# Altium schematic sheet cpuofmicrocontroller.SchDoc
size A4; SheetNumber: 4; SheetTotal: 5
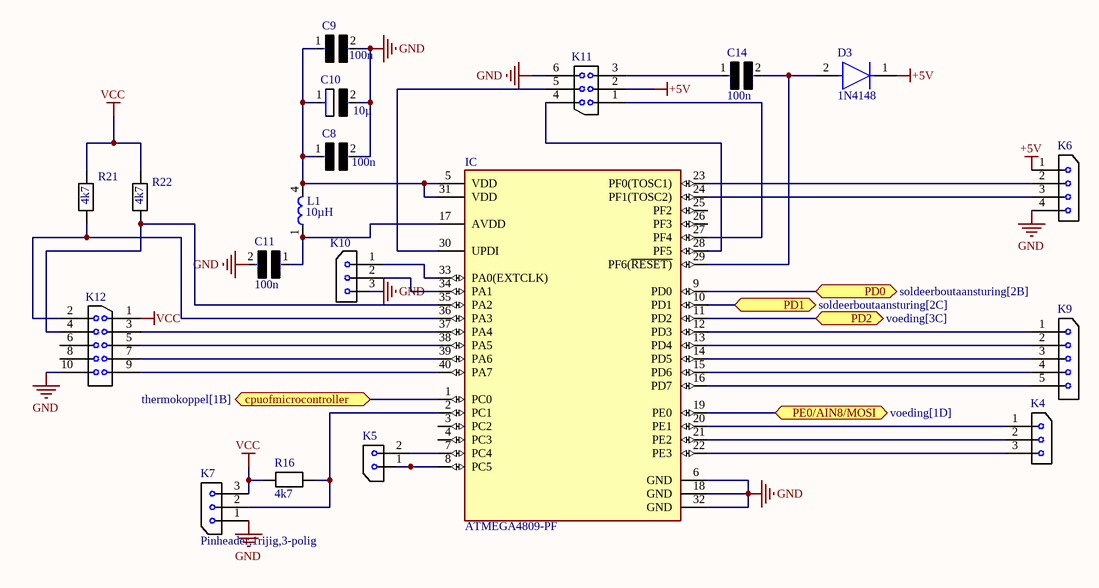
[diagram p0: cpuofmicrocontroller.SchDoc]

## Parts
C8  100n  [RESC2013X50X30LL20T20]
C9  100n  [RESC2013X50X30LL20T20]
C10  10µ  [RESC2013X50X30LL20T20]
C11  100n  [RESC2013X50X30LL20T20]
C14  100n  [RESC2013X50X30LL20T20]
D3  1N4148  [FP-017AG-MFG]
IC  ATMEGA4809-PF  [FP-C04-016-MFG]
K4  (no value)  [PINHEADER, 1RIJIG,3-POLIG]
K5  (no value)  [Pinheader,1rijig,2-polig]
K6  (no value)  [PINHEADER, 1RIJIG,4-POLIG - duplicate]
K7  Pinheader,1rijig,3-polig  [PINHEADER, 1RIJIG,3-POLIG]
K9  (no value)  [HDRV5W67P0X254_1X5_1270X241X858P]
K10  (no value)  [PINHEADER, 1RIJIG,3-POLIG]
K11  (no value)  [PINHEADER, 1RIJIG,6-POLIG - duplicate - duplicate]
K12  Pinheader,2rijig,10-polig  [PINHEADER, 2RIJIG,10-POLIG - duplicate - duplicate - duplicate]  (value not drawn)
L1  10µH  [Laird CM2545x171B-10]
R16  4k7  [RESC2013X50X30LL20T20]
R21  4k7  [RESC2013X50X30LL20T20]
R22  4k7  [RESC2013X50X30LL20T20]

## Ports
cpuofmicrocontroller (bidir, see thermokoppel[1B]), PD0 (bidir, see soldeerboutaansturing[2B]), PD1 (bidir, see soldeerboutaansturing[2C]), PD2 (bidir, see voeding[3C]), PE0/AIN8/MOSI (bidir, see voeding[1D])

## Nets
+5V: D3.1(C) K6.1 K11.2
GND: C8.2 C9.2 C10.2 C11.2 IC.6(GND) IC.18(GND) IC.32(GND) K6.4 K7.1 K10.3 K11.6 K12.10
VCC: K7.3 K12.1 R16.1 R21.2 R22.2
cpuofmicrocontroller: IC.1(PC0) ; port cpuofmicrocontroller
PD0: IC.9(PD0) ; port PD0
PD1: IC.10(PD1) ; port PD1
PD2: IC.11(PD2) ; port PD2
PE0/AIN8/MOSI: IC.19(PE0) ; port PE0/AIN8/MOSI
NetC8_1: C8.1 C9.1 C10.1 IC.5(VDD) IC.31(VDD) L1.4
NetC11_1: C11.1 IC.17(AVDD) L1.1
NetC14_1: C14.1 K11.3
NetC14_2: C14.2 D3.2(A) IC.29(PF6(~{RESET)})
NetIC_2: IC.2(PC1) K7.2 R16.2
NetIC_7: IC.7(PC4) K5.2
NetIC_8: IC.8(PC5) K5.1
NetIC_12: IC.12(PD3) K9.1
NetIC_13: IC.13(PD4) K9.2
NetIC_14: IC.14(PD5) K9.3
NetIC_15: IC.15(PD6) K9.4
NetIC_16: IC.16(PD7) K9.5
NetIC_20: IC.20(PE1) K4.1
NetIC_21: IC.21(PE2) K4.2
NetIC_22: IC.22(PE3) K4.3
NetIC_23: IC.23(PF0(TOSC1)) K6.2
NetIC_24: IC.24(PF1(TOSC2)) K6.3
NetIC_27: IC.27(PF4) K11.1
NetIC_28: IC.28(PF5) K11.4
NetIC_30: IC.30(UPDI) K11.5
NetIC_33: IC.33(PA0(EXTCLK)) K10.1
NetIC_34: IC.34(PA1) K10.2
NetIC_35: IC.35(PA2) K12.4 R22.1
NetIC_36: IC.36(PA3) K12.2 R21.1
NetIC_37: IC.37(PA4) K12.3
NetIC_38: IC.38(PA5) K12.5
NetIC_39: IC.39(PA6) K12.7
NetIC_40: IC.40(PA7) K12.9

Not connected (* = marked no-connect by the designer): IC 3(PC2) 4(PC3) 25(PF2) 26(PF3); K12 6 8

## Library data of the parts
C8 C9 C11 = capacitor2
C10 = Capacitor: CAP CER 0.1UF 10V X5R 0402; Manufacturer: Kemet; Manufacturer Part Number: C0402C104K8PACTU; Material: Ceramic; Capacitance: 0.10 μF; Temperature Coefficient: 15%; Tolerance: 0.1; Value: 0.10 μF; Package: C0402-BB; Temperature: -55°C to +125°C; ComponentLink2Description: Datasheet; Temperature Characteristic: X5R; Device Class L1: Passive Components; Height: 0.55mm; Lead Free: Yes; ComponentLink2URL: https://content.kemet.com/datasheets/KEM_C1002_X7R_SMD.pdf; Device Class L2: Capacitors; Temperature Range Low: -55°C; Temperature Range High: +125°C; RoHS: TRUE; Octopart: https://octopart.com/c0402c104k8pactu-kemet-140039; Automotive: No; Mouser Description: Capacitor 100 nF 10 VDC 0402 | KEMET C0402C104K8PACTU (Capacitor 100 nF 10 VDC 0402 Ceramic Capacitors).; Category: Cap; Voltage Rating: 10 V; Digikey Description: CAP CER 0.1UF 10V X5R 0402; Ipc Land Pattern Name: CAPC10050X50; Device Class L3: Ceramic Capacitors
C14 = Ceramische Capacitor
D3 = 1N4148: DIODE GEN PURP 100V 200MA DO35/1N4148; Forward Voltage: 1V; Max Power Dissipation: 500mW; Max Reverse Current: 5uA; Forward Current: 300mA; Current: 4A; Reverse Recovery Time: 4ns; Element Configuration: Single; Outside Diameter: 1.85mm; Capacitance: 4pF; Polarity: Standard; Max Forward Surge Current (Ifsm): 1A; Reverse Voltage: 100V; Output Current: 200mA; Average Rectified Current: 200mA; Diameter: 1.91mm; Max Repetitive Reverse Voltage (Vrrm): 100V; Current Rating: 200mA; Case/Package: DO-35; Lead Free: Lead Free; Number of Pins: 2; Recovery Time: 4ns; Packaging: Bulk; Contact Plating: Tin; Voltage: 100V; Mount: Through Hole; Max Surge Current: 4A; Package Quantity: 2000; Width: 1.91mm; Max Reverse Voltage (DC): 100V; Length: 4.56mm; Radiation Hardening: No; Power Dissipation: 500mW; Voltage Rating (DC): 100V; Peak Non-Repetitive Surge Current: 4A; REACH SVHC: No SVHC; Height: 4.56mm; Max Operating Temperature: 175°C; Series: -; Weight: 0.01lb; Min Operating Temperature: -65°C
IC = aTmega4809-PF: IC MCU 8BIT 48KB FLASH 40DIP; RoHS Compliant: Yes
K4 K10 = Pinheader,1rijig,3-polig
K5 = Pinheader,1rijig,2-polig
K6 = Pinheader,1rijig,4-polig
K9 = 5PIN HEADERmale: Connector; Manufacturer_Name: Amphenol Communications Solutions; Manufacturer_Part_Number: 68000-105HTLF; Datasheet Link: https://cdn.amphenol-cs.com/media/wysiwyg/files/drawing/68000.pdf; Height: 8.58mm; Mouser Part Number: 649-68000-105HTLF; Mouser Price/Stock: https://www.mouser.co.uk/ProductDetail/Amphenol-FCI/68000-105HTLF?qs=w%2Fv1CP2dgqrYgNyQVoiqDw%3D%3D; Arrow Part Number: 68000-105HTLF; Arrow Price/Stock: https://www.arrow.com/en/products/68000-105htlf/amphenol-fci
K11 = Pinheader,2rijig,6-polig
L1 = spoelL1
R16 R21 R22 = weerstand: Manufacturer: Vishay Dale; Part Number: CRCW08050000Z0EA